# EAGLE design ZemoteShield (EAGLE 7.2.0)
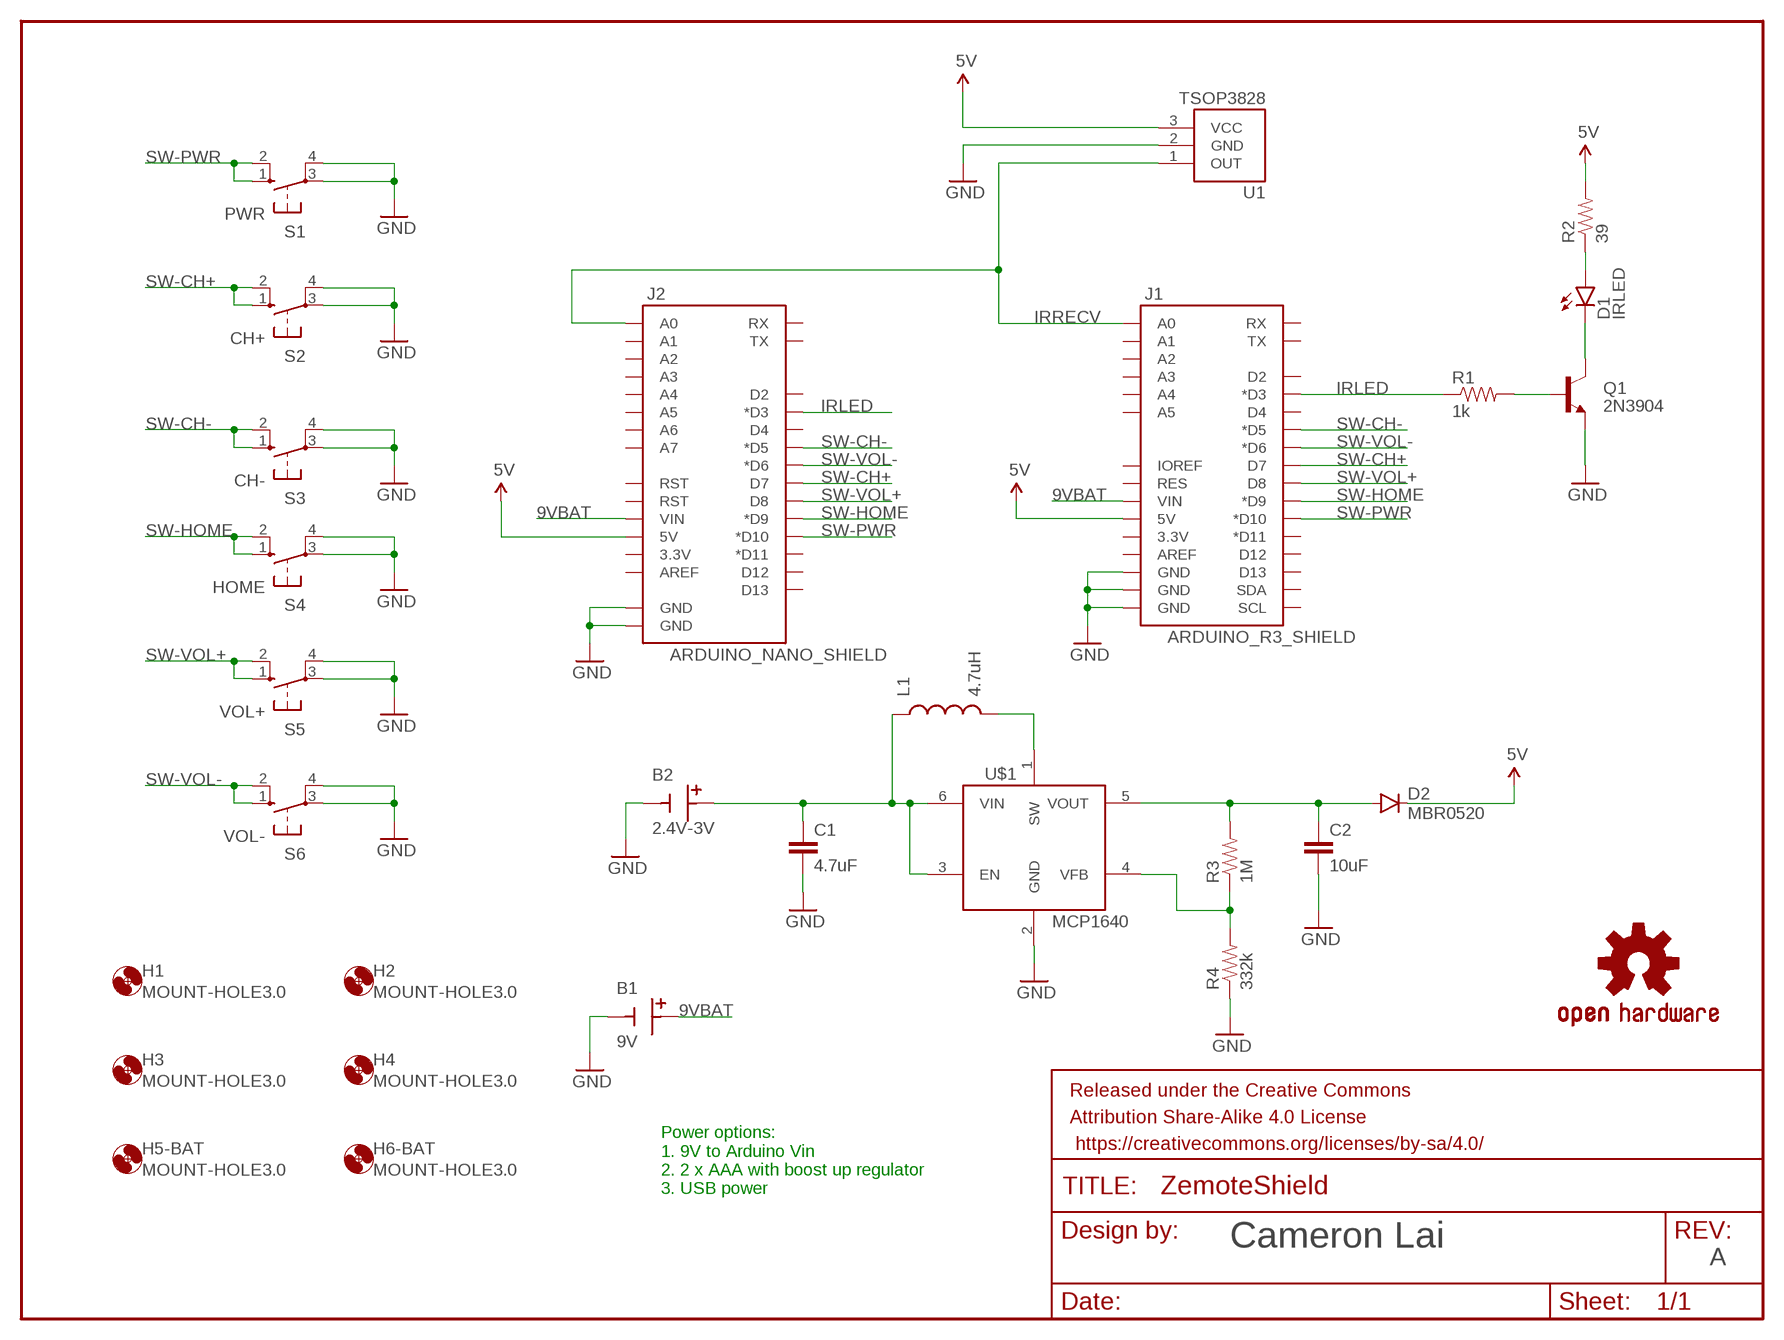
[diagram p0: schematic, sheet 1]

## Parts
B1  9V  BATTERY-HOLES  [BATTERY-2PIN-CON]
B2  2.4V-3V  BATTERY-HOLES  [BATTERY-2PIN-CON]
C1  4.7uF  4.7UF-6.3V-10%(0603)0603  [0603-CAP]
C2  10uF  CAP0805  [0805]
D1  IRLED  LED5MM  [LED5MM]
D2  MBR0520  DIODESOD123  [SOD-123]
FRAME1  ZemoteShield  FRAME-LETTERNO_PACKAGE  [DUMMY]
H1  MOUNT-HOLE3.0  [3,0]
H2  MOUNT-HOLE3.0  [3,0]
H3  MOUNT-HOLE3.0  [3,0]
H4  MOUNT-HOLE3.0  [3,0]
H5-BAT  MOUNT-HOLE3.0  [3,0]
H6-BAT  MOUNT-HOLE3.0  [3,0]
J1  ARDUINO_R3_SHIELD  [UNO_R3_SHIELD]
J2  ARDUINO_NANO_SHIELD  [NANO_SHIELD]
L1  4.7uH  INDUCTOR1210  [1210]
LOGO1  OSHW-LOGOL  [OSHW-LOGO-L]
Q1  2N3904  TRANSISTOR_NPN2N3904  [TO-92]
R1  1k  RESISTORPTH-1/4W  [AXIAL-0.4]
R2  39  RESISTORPTH-1W  [AXIAL-0.6]
R3  1M  RESISTOR0603  [0603-RES]
R4  332k  RESISTOR0603  [0603-RES]
S1  PWR  10-XX  [B3F-10XX]
S2  CH+  10-XX  [B3F-10XX]
S3  CH-  10-XX  [B3F-10XX]
S4  HOME  10-XX  [B3F-10XX]
S5  VOL+  10-XX  [B3F-10XX]
S6  VOL-  10-XX  [B3F-10XX]
U1  TSOP3828  BRM-2A18RA  [BRM-2508]
U$1  MCP1640  [SOT23-6]

## Nets
5V: D2.C J1.5V J2.5V R2.P$2 U1.3(VCC)
9VBAT: B1.POS J1.VIN J2.VIN
AAABAT: B2.POS C1.1 L1.1 U$1.3(EN) U$1.6(VIN)
GND: B1.NEG B2.NEG C1.2 C2.2 J1.GND@0(GND) J1.GND@1(GND) J1.GND@2(GND) J2.GND@0(GND) J2.GND@1(GND) Q1.1(E) R4.1 S1.3(P) S1.4(P1) S2.3(P) S2.4(P1) S3.3(P) S3.4(P1) S4.3(P) S4.4(P1) S5.3(P) S5.4(P1) S6.3(P) S6.4(P1) U1.2(GND) U$1.2(GND)
IRLED: J1.D3(*D3) J2.D3(*D3) R1.P$1
IRRECV: J1.A0 J2.A0 U1.1(OUT)
N$1: D1.K(C) Q1.3(C)
N$2: Q1.2(B) R1.P$2
N$3: D1.A R2.P$1
N$4: L1.2 U$1.1(SW)
N$5: C2.1 D2.A R3.2 U$1.5(VOUT)
N$6: R3.1 R4.2 U$1.4(VFB)
SW-CH+: J1.D7 J2.D7 S2.1(S) S2.2(S1)
SW-CH-: J1.D5(*D5) J2.D5(*D5) S3.1(S) S3.2(S1)
SW-HOME: J1.D9(*D9) J2.D9(*D9) S4.1(S) S4.2(S1)
SW-PWR: J1.D10(*D10) J2.D10(*D10) S1.1(S) S1.2(S1)
SW-VOL+: J1.D8 J2.D8 S5.1(S) S5.2(S1)
SW-VOL-: J1.D6(*D6) J2.D6(*D6) S6.1(S) S6.2(S1)
Unconnected: J1.3.3V J1.A1 J1.A2 J1.A3 J1.A4 J1.A5 J1.AREF J1.D2 J1.D4 J1.D11(*D11) J1.D12 J1.D13 J1.IOREF J1.RES J1.RX J1.SCL J1.SDA J1.TX J2.3.3V J2.A1 J2.A2 J2.A3 J2.A4 J2.A5 J2.A6 J2.A7 J2.AREF J2.D2 J2.D4 J2.D11(*D11) J2.D12 J2.D13 J2.RST@0(RST) J2.RST@1(RST) J2.RX J2.TX

## Notes on the sheet
- Power options:
  1. 9V to Arduino Vin
  2. 2 x AAA with boost up regulator
  3. USB power

## Library data of the parts
B1 B2 = battery:BATTERY-HOLES
C1 = SparkFun-Capacitors:4.7UF-6.3V-10%(0603): CAP-08280; PROD_ID: CAP-08280
C2 = SparkFun-Capacitors:CAP: Capacitor Standard 0603 ceramic capacitor, and 0.1" leaded capacitor.
D1 = SparkFun-LED:LED: LEDs Standard schematic elements and footprints for 5mm, 3mm, 1206, and 0603 sized LEDs. 5mm - Spark Fun Electronics SKU : COM-00529 (and others)
D2 = SparkFun-DiscreteSemi:DIODE: Diode These are standard reverse protection diodes and small signal diodes. SMA package can handle up to about 1A. SOD-323 can handle about 200mA. What the SOD-323 package when ordering, there are some mfgs out there that are 5-pin packages.
FRAME1 = SparkFun-Aesthetics:FRAME-LETTER: Schematic Frame Standard 8.5x11 US Letter frame; DESIGNER: Cameron Lai; VERSION: A
H1-H4 H5-BAT H6-BAT = holes:MOUNT-HOLE: MOUNTING HOLE with drill center marker
J1 = SparkFun-Boards:ARDUINO_R3_SHIELD: Shield form compatible with the Arduino Uno R3.
J2 = ArduinoShield:ARDUINO_NANO_SHIELD: Shield form compatible with the Arduino Nano.
L1 = SparkFun-Passives:INDUCTOR: Inductors Basic Inductor/Choke - 0603 and 1206. Footprints are not proven and vary greatly between part numbers. SRN6045- 33uH, 20% 1.4A SDR0403-560KL - 56uH, 10%, 500mA RMS/740mA peak
LOGO1 = SparkFun-Aesthetics:OSHW-LOGO: Open Source Hardware Logo This logo indicates the piece of hardware it is found on incorporates a OSHW license and/or adheres to the definition of open source hardware found here: http://freedomdefined.org/OSHW
Q1 = SparkFun-DiscreteSemi:TRANSISTOR_NPN: Generic NPN BJT MMBT2222A - TRANS-08049 (SOT-23, 1A 40V) MPSA42 - TRANS-09116 (SOT-23, 500mA 300V) MMBT5088LT1G - TRANS-11160 (SOT-23, 50 mA 30V) BC547 - COM-08928 <http://www.sparkfun.com/products/8928> (TO-92 45V 100mA) (1.Collector 2.Base 3.Emitter) 2N3904 - COM-00521 <http://www.sparkfun.com/products/521> (TO-92 40V 200mA) (1.Emitter 2.Base 3.Collector) P2N2222A - COM-12852 <http://www.sparkfun.com/products/12852> (TO-92 40V 600mA) (1.Collector 2.Base 3.Emitter); PROD_ID: TRANS-08447
R1-R4 = SparkFun-Resistors:RESISTOR: Resistor Basic schematic elements and footprints for 0603, 1206, and PTH resistors.
S1-S6 = switch-omron-changed:10-XX: OMRON SWITCH; MPN: B3F-1000; OC_FARNELL: 176432; OC_NEWARK: 36M3542
U1 = SparkFun-Sensors:BRM-2A18: BRM-2A18 IR receiver.
U$1 = GeekAmmo:MCP1640: MCP1640 0.65V Start-up Synchronous Boost Regulator with True Output Disconnect or Input/Output Bypass Option The MCP1640/B/C/D is a compact, high-efficiency, fixed frequency, synchronous step-up DC-DC converter. http://ww1.microchip.com/downloads/en/DeviceDoc/22234B.pdf

## Board
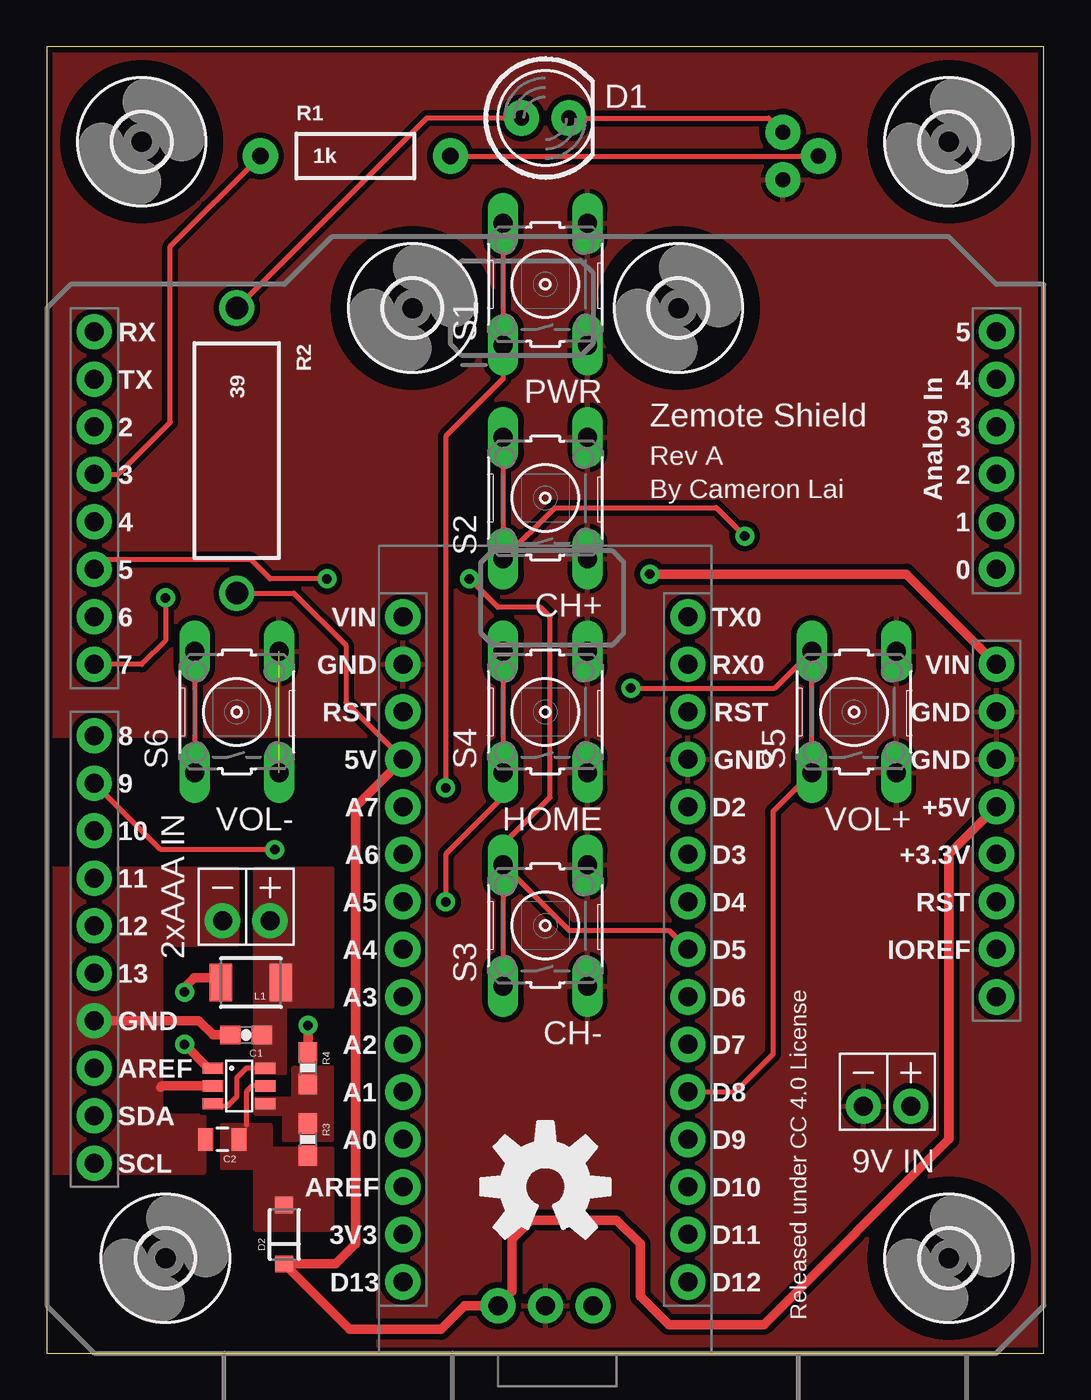
[diagram p1: board, top side]
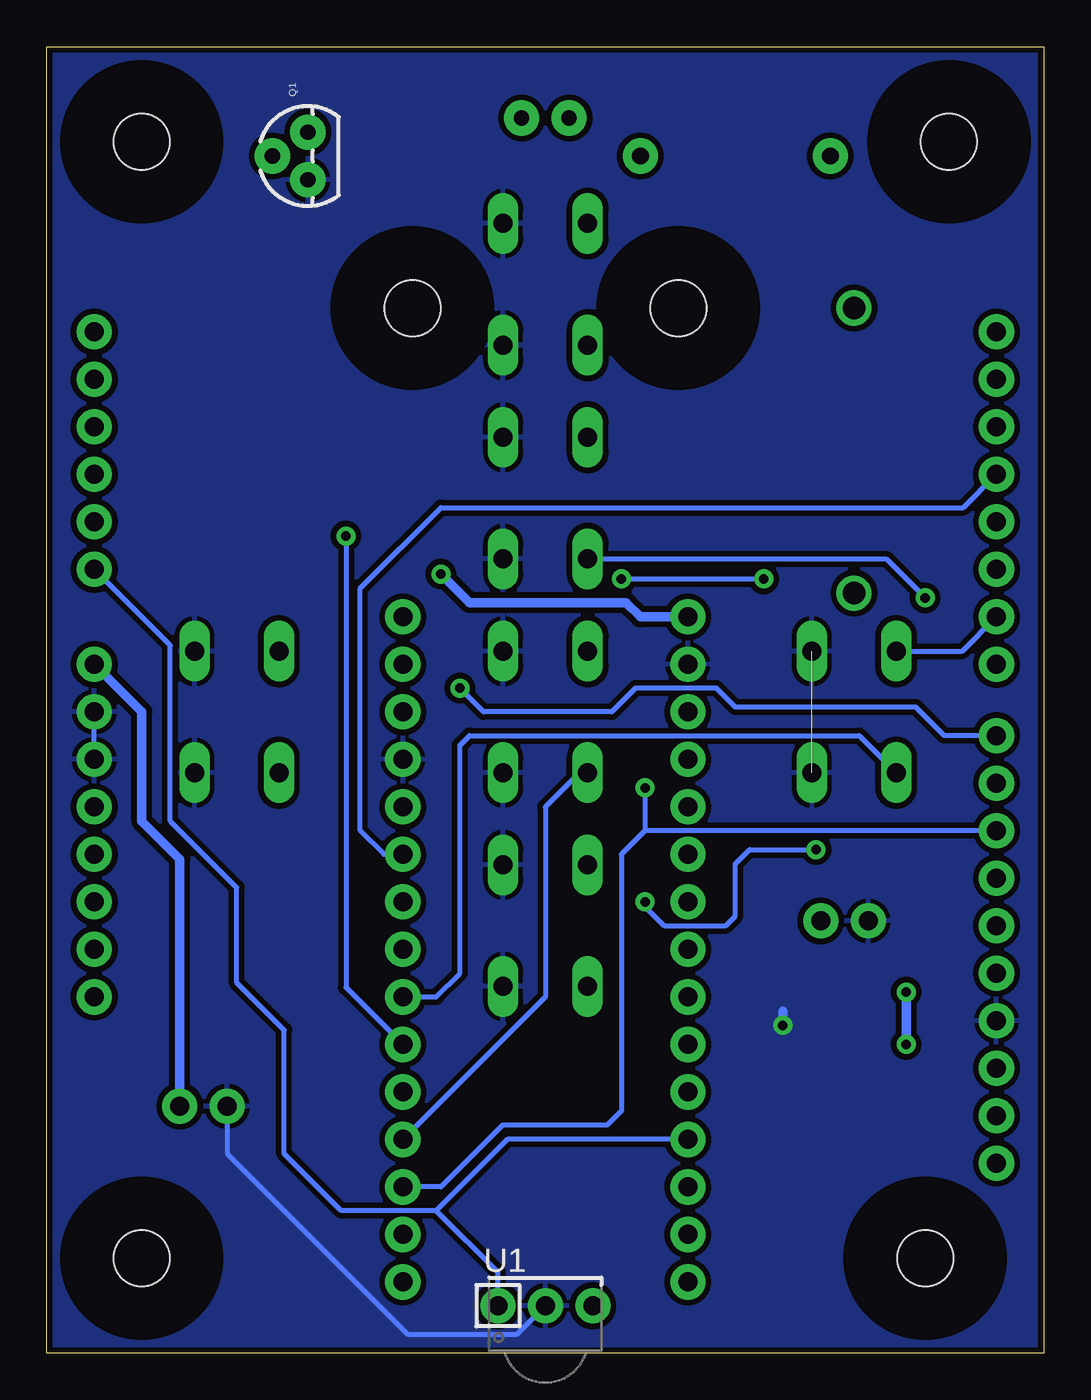
[diagram p2: board, bottom side, seen from below]

Size 53.34 x 69.85 mm. Coordinates in mm from the lower left corner, seen from the top.
Outline: 0,0 53.34,0 53.34,69.85 0,69.85 0,0
Copper layers (1*16): Top 0.035mm / dielectric 1.5mm / Bottom 0.035mm
Design rules "SparkFun": minimum track width 8mil, minimum drill 20mil, track to track 8mil, track to pad 8mil, pad to pad 8mil, via to via 8mil, smd to smd 8mil, copper to edge 8mil, drill to drill 8mil, minimum pad ring 12mil, minimum via ring 10mil, stop-mask expansion 4mil, vias tented up to drill 20mil, thermal gap 10mil

### Footprints (pad centres in the part's own frame; a part is rotated, then mirrored left to right if it is on the bottom)
BATTERY-2PIN-CON = drill 1.016 pad 1.88: NEG -1.27,0; POS 1.27,0
0603-CAP = smd 1.1 x 1: 1 -0.85,0; 2 0.85,0
0805 = smd 0.8 x 1.2: 1 -0.9,0; 2 0.9,0
LED5MM = drill 0.813 pad 1.88: A -1.27,0; K 1.27,0
SOD-123 = smd 0.9 x 0.95: A 1.575,0; C -1.575,0
3,0 = hole 3: 0,0
UNO_R3_SHIELD = drill 1.016 pad 1.88: 3.3V 50.8,26.67; 5V 50.8,29.21; A0 50.8,41.91; A1 50.8,44.45; A2 50.8,46.99; A3 50.8,49.53; A4 50.8,52.07; A5 50.8,54.61; AREF 2.54,15.24; D2 2.54,49.53; D3 2.54,46.99; D4 2.54,44.45; D5 2.54,41.91; D6 2.54,39.37; D7 2.54,36.83; D8 2.54,33.02; D9 2.54,30.48; D10 2.54,27.94; D11 2.54,25.4; D12 2.54,22.86; D13 2.54,20.32; GND@0 50.8,31.75; GND@1 50.8,34.29; GND@2 2.54,17.78; IOREF 50.8,21.59; NC 50.8,19.05; RES 50.8,24.13; RX 2.54,54.61; SCL 2.54,10.16; SDA 2.54,12.7; TX 2.54,52.07; VIN 50.8,36.83
NANO_SHIELD = drill 1.016 pad 1.88: 3.3V 1.27,6.35; 5V 1.27,31.75; A0 1.27,11.43; A1 1.27,13.97; A2 1.27,16.51; A3 1.27,19.05; A4 1.27,21.59; A5 1.27,24.13; A6 1.27,26.67; A7 1.27,29.21; AREF 1.27,8.89; D2 16.51,29.21; D3 16.51,26.67; D4 16.51,24.13; D5 16.51,21.59; D6 16.51,19.05; D7 16.51,16.51; D8 16.51,13.97; D9 16.51,11.43; D10 16.51,8.89; D11 16.51,6.35; D12 16.51,3.81; D13 1.27,3.81; GND@0 1.27,36.83; GND@1 16.51,31.75; RST@0 1.27,34.29; RST@1 16.51,34.29; RX 16.51,36.83; TX 16.51,39.37; VIN 1.27,39.37
1210 = smd 1.2 x 2: 1 -1.6,0; 2 1.6,0
TO-92 = drill 0.813 pad 1.88: 1 -1.27,0; 2 0,1.905; 3 1.27,0
AXIAL-0.4 = drill 0.9 pad 1.88: P$1 -5.08,0; P$2 5.08,0
AXIAL-0.6 = drill 1.2 pad 1.88: P$1 -7.62,0; P$2 7.62,0
0603-RES = smd 1.1 x 1: 1 -0.85,0; 2 0.85,0
B3F-10XX = drill 1.016 long: 1 -3.251,2.261; 2 3.251,2.261; 3 -3.251,-2.261; 4 3.251,-2.261
BRM-2508 = drill 1.016 pad 1.88: 1 -2.54,0; 2 0,0; 3 2.54,0
SOT23-6 = smd 0.6 x 1.1: 1 0,0; 2 0.95,0; 3 1.9,0; 4 1.9,2.8; 5 0.95,2.8; 6 0,2.8

### Placement (x,y rotation side)
B1  44.96,13.21 0 top
B2  10.67,23.11 0 top
C1  10.67,17.02 180 top
C2  9.4,11.43 180 top
D1  26.67,66.04 0 top
D2  12.7,6.35 90 top
FRAME1  0,-16.51 0 top  (outside the outline)
H1  6.35,5.08 0 top
H2  5.08,64.77 0 top
H3  48.26,5.08 0 top
H4  48.26,64.77 0 top
H5-BAT  19.56,55.88 0 top
H6-BAT  33.78,55.88 0 top
J1  0,0 0 top
J2  17.78,0 0 top
L1  10.92,19.81 180 top
LOGO1  26.67,8.89 0 top
Q1  39.37,64.01 90 bottom
R1  16.51,64.01 0 top
R2  10.16,48.26 270 top
R3  13.97,11.43 270 top
R4  13.97,15.24 270 top
S1  26.67,57.15 90 top
S2  26.67,45.72 90 top
S3  26.67,22.86 90 top
S4  26.67,34.29 90 top
S5  43.18,34.29 90 top
S6  10.16,34.29 90 top
U1  26.67,2.54 0 bottom
U$1  8.89,15.24 270 top

### Tracks (layer width: path | path; a pad name or v marks a point on that pad's centre or on a via)
5V
  Top 0.254: R2.P$2 13.21,40.64 16,37.85 16,34.8 J2.5V
  Top 0.508: J2.5V 16.51,29.21 16.51,5.84 15.44,4.78 D2.C 16.2,1.27 21.08,1.27 22.35,2.54 U1.3 24.89,3.3 24.89,6.1 25.91,7.11 30.48,7.11 31.75,5.84 31.75,3.05 33.27,1.52 38.35,1.52 48.26,11.43 48.26,26.67 J1.5V
9VBAT  (via drill 0.51)
  Top 0.508: J1.VIN 45.97,41.66 v32.26,41.66
  Bottom 0.508: B1.POS 46.23,26.42 48.26,28.45 48.26,34.29 J1.VIN | J2.VIN 21.59,39.37 22.35,40.13 30.73,40.13 v32.26,41.66
AAABAT
  Top 0.254: 9.01,13.46 U$1.3 9.02,13.21 9.65,13.21 10.16,13.72 10.16,14.73 10.67,15.24 U$1.6
  pour Top (no thermals): 11.18,14.99 11.18,25.91 15.24,25.91 15.24,18.54 12.7,18.54 12.7,14.99
GND  (via drill 0.51)  (1 unrouted)
  Top 0.508: U$1.2 6.16,14.29 6.1,14.22 | C1.2 8.89,17.02 8.13,17.78 J1.GND@2 | R4.1 v13.97,17.53
  Bottom 0.254: B1.NEG 43.69,10.67 34.04,1.02 28.19,1.02 U1.2 | J1.GND@0 J1.GND@1
  Bottom 0.508: v13.97,17.53 13.97,18.29
  pour Top (isolate 0.305, no thermals): 8.38,12.7 8.38,9.65 0,9.65 0,25.91 10.16,25.91 10.16,21.84 6.1,21.84 6.1,12.7
  pour Bottom (isolate 0.305): 0,69.85 53.34,69.85 53.34,0 0,0
  pour Top (isolate 0.305): 0,69.85 53.34,69.85 53.34,0 17.78,0 17.78,33.02 0,33.02
IRLED
  Top 0.254: J1.D3 3.81,46.99 6.6,49.78 6.6,59.18 R1.P$1
  Bottom 0.254: J2.D3 35.31,26.67 36.58,27.94 36.58,40.89 32.26,45.21 4.32,45.21 J1.D3
IRRECV
  Bottom 0.254: J2.A0 28.7,11.43 32.51,7.62 | 32.51,7.62 37.59,7.62 40.64,10.67 40.64,17.27 43.18,19.81 43.18,24.89 46.74,28.45 46.74,37.85 J1.A0 | U1.1 29.21,4.32 32.51,7.62
N$1
  Top 0.254: D1.K 38.61,66.04 Q1.3
N$2
  Top 0.254: R1.P$2 Q1.2
N$3
  Top 0.254: D1.A 20.32,66.04 R2.P$1
N$4  (via drill 0.51)
  Top 0.508: U$1.1 8.64,15.24 v7.37,16.51 | v7.37,19.3 7.37,19.56 7.87,20.07 9.07,20.07 L1.2
  Bottom 0.508: v7.37,16.51 v7.37,19.3
N$5
  Top 0.254: U$1.5 10.99,14.29 10.67,13.97 10.67,12.19
  Top 0.508: 10.41,11.55 C2.1
  pour Top (no thermals): 9.4,12.19 11.94,12.19 11.94,10.92 15.24,10.92 15.24,6.6 11.18,6.6 11.18,7.37 11.18,9.91 9.4,9.91
N$6
  pour Top (no thermals): 11.18,12.83 12.7,12.83 12.7,11.43 15.24,11.43 15.24,15.24 13.21,15.24 13.21,13.59 11.18,13.59
SW-CH+  (via drill 0.51)
  Top 0.254: S2.2 S2.1 24.43,42.47 27.18,45.21 35.81,45.21 v37.34,43.69 | v6.35,40.39 6.35,38.1 5.08,36.83 J1.D7
  Bottom 0.254: v37.34,43.69 37.34,19.56 J2.D7 | S2.1 8.43,42.47 v6.35,40.39
SW-CH-  (via drill 0.51)
  Top 0.254: S3.2 S3.1 | S3.2 24.43,26.11 27.94,22.61 33.27,22.61 J2.D5 | S3.2 24.41,27.2 26.92,29.72 26.92,39.37 26.42,39.88 24.13,39.88 v22.61,41.4 | v14.99,41.4 11.94,41.4 10.92,42.42 3.05,42.42 J1.D5
  Bottom 0.254: v22.61,41.4 v14.99,41.4
SW-HOME  (via drill 0.51)
  Top 0.254: S4.2 S4.1 24.41,29.74 21.34,26.67 v21.34,24.13 | v12.19,26.92 6.1,26.92 J1.D9
  Bottom 0.254: S4.1 24.84,31.04 26.67,29.21 26.67,19.05 J2.D9 | v21.34,24.13 21.34,23.88 20.32,22.86 17.02,22.86 16.51,23.37 16.51,26.16 15.75,26.92 v12.19,26.92
SW-PWR  (via drill 0.51)
  Top 0.254: S1.2 S1.1 24.41,52.09 21.34,49.02 v21.34,30.23
  Bottom 0.254: J1.D10 21.34,27.94 | J2.D10 32.26,8.89 28.96,12.19 23.37,12.19 22.61,12.95 22.61,26.67 21.34,27.94 | v21.34,30.23 21.34,27.94
SW-VOL+  (via drill 0.51)
  Top 0.254: J2.D8 36.83,13.97 38.86,16 38.86,28.98 S5.1 S5.2 38.94,35.56 v31.24,35.56
  Bottom 0.254: J1.D8 5.33,33.02 6.86,34.54 16.51,34.54 17.53,35.56 21.84,35.56 23.11,34.29 29.97,34.29 v31.24,35.56
SW-VOL-
  Top 0.254: S6.2 S6.1
  Bottom 0.254: S6.2 4.37,37.54 J1.D6 | J2.D6 32.51,19.05 31.24,20.32 31.24,32.51 30.73,33.02 9.88,33.02 S6.1

### Text on the board
tPlace: Zemote Shield | Rev A | By Cameron Lai | 2xAAA IN | 9V IN | Released under CC 4.0 License
tPlate: AAA BAT | 9V BAT